# EAGLE design ihm_shield (EAGLE 7.2.0)
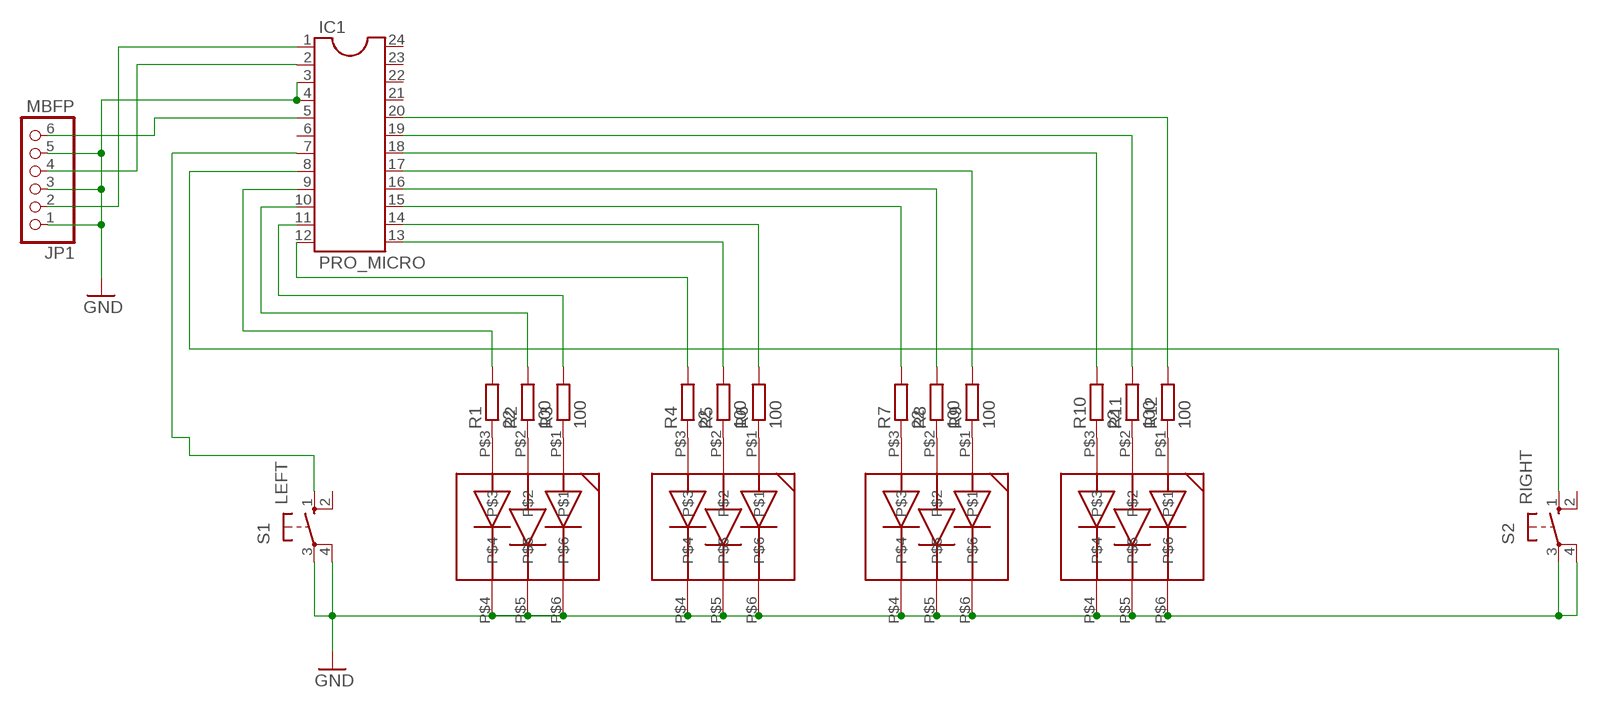
[diagram p0: schematic, sheet 1]

## Parts
IC1  PRO_MICRO  DIL24-6  [DIL24-6]
JP1  MBFP  PINHD-1X6/90  [1X06/90]
R1  22  R-EU_R0805  [R0805]
R2  100  R-EU_R0805  [R0805]
R3  100  R-EU_R0805  [R0805]
R4  22  R-EU_R0805  [R0805]
R5  100  R-EU_R0805  [R0805]
R6  100  R-EU_R0805  [R0805]
R7  22  R-EU_R0805  [R0805]
R8  100  R-EU_R0805  [R0805]
R9  100  R-EU_R0805  [R0805]
R10  22  R-EU_R0805  [R0805]
R11  100  R-EU_R0805  [R0805]
R12  100  R-EU_R0805  [R0805]
S1  LEFT  10-XX  [B3F-10XX]
S2  RIGHT  10-XX  [B3F-10XX]
U$1  5050LED  [PLCC-6]
U$2  5050LED  [PLCC-6]
U$3  5050LED  [PLCC-6]
U$4  5050LED  [PLCC-6]

## Nets
GND: IC1.3 IC1.4 JP1.1 JP1.3 JP1.5 S1.3(P) S1.4(P1) S2.3(P) S2.4(P1) U$1.P$4 U$1.P$5 U$1.P$6 U$2.P$4 U$2.P$5 U$2.P$6 U$3.P$4 U$3.P$5 U$3.P$6 U$4.P$4 U$4.P$5 U$4.P$6
N$1: R4.1 U$2.P$3
N$2: R5.1 U$2.P$2
N$3: R6.1 U$2.P$1
N$4: R7.1 U$3.P$3
N$5: R8.1 U$3.P$2
N$6: R9.1 U$3.P$1
N$7: R1.1 U$1.P$3
N$8: R2.1 U$1.P$2
N$9: R3.1 U$1.P$1
N$11: R10.1 U$4.P$3
N$12: R11.1 U$4.P$2
N$13: IC1.1 JP1.2
N$14: IC1.2 JP1.4
N$15: IC1.5 JP1.6
N$16: R12.1 U$4.P$1
N$17: IC1.20 R12.2
N$18: IC1.19 R11.2
N$19: IC1.18 R10.2
N$20: IC1.17 R9.2
N$21: IC1.16 R8.2
N$22: IC1.15 R7.2
N$23: IC1.14 R6.2
N$24: IC1.13 R5.2
N$25: IC1.12 R4.2
N$26: IC1.11 R3.2
N$27: IC1.10 R2.2
N$28: IC1.9 R1.2
N$29: IC1.7 S1.1(S)
N$30: IC1.8 S2.1(S)
Unconnected: IC1.6 IC1.21 IC1.22 IC1.23 IC1.24 S1.2(S1) S2.2(S1)

## Library data of the parts
IC1 = ic-package:DIL24: Dual In Line
JP1 = pinhead:PINHD-1X6: PIN HEADER
R1-R12 = rcl:R-EU_: RESISTOR, European symbol
S1 S2 = switch-omron:10-XX: OMRON SWITCH; MPN: B3F-1000; OC_FARNELL: 176432; OC_NEWARK: 36M3542
U$1-U$4 = 5050led:5050LED: Classical 5050 RGB LED in PLCC-6 package

## Board
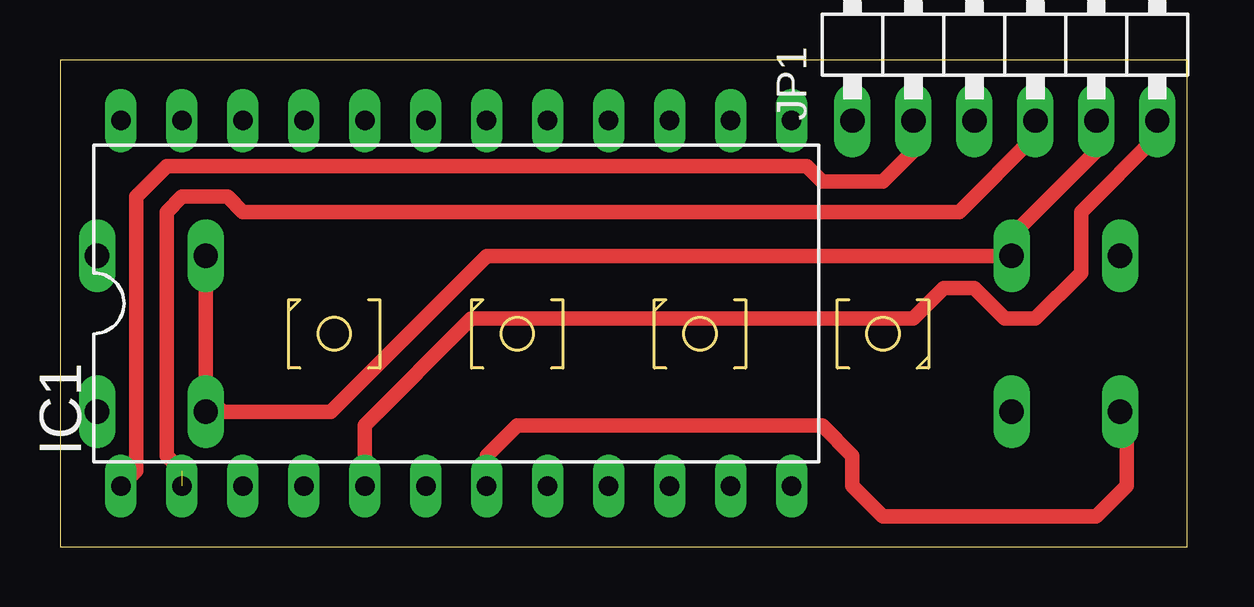
[diagram p1: board, top side]
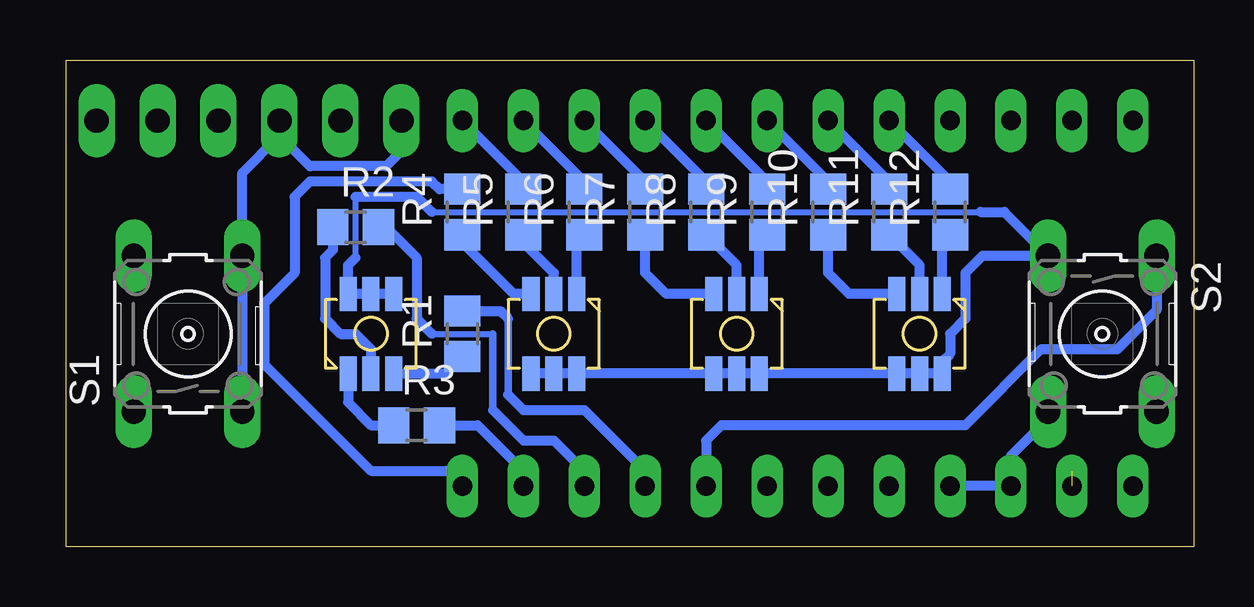
[diagram p2: board, bottom side, seen from below]

Size 46.98 x 20.31 mm. Coordinates in mm from the lower left corner, seen from the top.
Outline: 0,0 46.98,0 46.98,20.31 0,20.31 0,0
Copper layers (1*16): Top 0.035mm / dielectric 1.5mm / Bottom 0.035mm
Design rules "default": minimum track width 10mil, minimum drill 24mil, track to track 8mil, track to pad 8mil, pad to pad 8mil, via to via 8mil, smd to smd 8mil, copper to edge 40mil, drill to drill 8mil, minimum pad ring 10mil, minimum via ring 8mil, stop-mask expansion 4mil, vias tented up to drill 0mil, thermal gap 10mil

### Footprints (pad centres in the part's own frame; a part is rotated, then mirrored left to right if it is on the bottom)
DIL24-6 = drill 0.813 long: 1 -13.97,-7.62; 2 -11.43,-7.62; 3 -8.89,-7.62; 4 -6.35,-7.62; 5 -3.81,-7.62; 6 -1.27,-7.62; 7 1.27,-7.62; 8 3.81,-7.62; 9 6.35,-7.62; 10 8.89,-7.62; 11 11.43,-7.62; 12 13.97,-7.62; 13 13.97,7.62; 14 11.43,7.62; 15 8.89,7.62; 16 6.35,7.62; 17 3.81,7.62; 18 1.27,7.62; 19 -1.27,7.62; 20 -3.81,7.62; 21 -6.35,7.62; 22 -8.89,7.62; 23 -11.43,7.62; 24 -13.97,7.62
1X06/90 = drill 1.016 long: 1 -6.35,-3.81; 2 -3.81,-3.81; 3 -1.27,-3.81; 4 1.27,-3.81; 5 3.81,-3.81; 6 6.35,-3.81
R0805 = smd 1.3 x 1.5: 1 -0.95,0; 2 0.95,0
B3F-10XX = drill 1.016 long: 1 -3.251,2.261; 2 3.251,2.261; 3 -3.251,-2.261; 4 3.251,-2.261
PLCC-6 = smd 0.711 x 1.422: P$1 0.95,1.663; P$2 0,1.663; P$3 -0.95,1.663; P$4 -0.95,-1.663; P$5 0,-1.663; P$6 0.95,-1.663

### Placement (x,y rotation side)
IC1  16.51,10.16 0 top
JP1  39.37,21.59 0 top
R1  30.48,8.89 90 bottom
R2  34.92,13.34 0 bottom
R3  32.38,5.08 0 bottom
R4  30.48,13.97 90 bottom
R5  27.94,13.97 90 bottom
R6  25.4,13.97 90 bottom
R7  22.86,13.97 90 bottom
R8  20.32,13.97 90 bottom
R9  17.78,13.97 90 bottom
R10  15.24,13.97 90 bottom
R11  12.7,13.97 90 bottom
R12  10.16,13.97 90 bottom
S1  41.91,8.89 90 bottom
S2  3.81,8.89 270 bottom
U$1  34.29,8.89 180 bottom
U$2  26.67,8.89 0 bottom
U$3  19.05,8.89 0 bottom
U$4  11.43,8.89 0 bottom

### Tracks (layer width: path | path; a pad name or v marks a point on that pad's centre or on a via)
GND
  Top 0.61: JP1.5 43.18,16.51 39.65,12.98 S1.4 17.78,12.14 11.28,5.64 6.78,5.64 6.07,6.35 | S2.4 6.07,6.35 | 6.07,6.35 S2.3
  Bottom 0.254: 34.92,12.06 34.92,14.61 | 31.75,13.97 8.89,13.97
  Bottom 0.406: U$2.P$4 U$2.P$5 U$2.P$6 U$3.P$4 U$3.P$5 U$3.P$6 U$4.P$4 U$4.P$5 U$4.P$6 10.48,7.73 10.16,8.05 10.16,8.89 9.53,9.53 9.53,11.43 8.81,12.14 S2.3 7.9,13.97 8.89,13.97 | U$1.P$4 U$1.P$5 U$1.P$6 35.24,11.75 34.92,12.06 | 34.92,14.61 32.38,14.61 31.75,13.97 | S2.4 6.07,5.36 7.62,3.81 IC1.3 IC1.4 | JP1.1 33.02,16.51 33.66,15.88 36.83,15.88 38.1,17.14 | 38.1,17.14 JP1.3 | 38.1,17.14 39.65,15.6 S1.4 S1.3
N$1
  Bottom 0.406: U$2.P$3 28.33,10.55 30.48,12.7 R4.1
N$2
  Bottom 0.406: U$2.P$2 26.67,11.43 27.94,12.7 R5.1
N$3
  Bottom 0.406: U$2.P$1 25.72,12.7 R6.1
N$4
  Bottom 0.406: U$3.P$3 21.98,10.55 22.86,11.43 R7.1
N$5
  Bottom 0.406: U$3.P$2 19.05,11.75 R8.1
N$6
  Bottom 0.406: U$3.P$1 18.1,12.7 R9.1
N$7
  Bottom 0.406: U$1.P$3 31.19,7.23 R1.1
N$8
  Bottom 0.406: R2.1 35.88,12.38 36.2,12.06 36.2,9.53 35.56,8.89 34.92,8.89 34.29,8.26 U$1.P$2
N$9
  Bottom 0.406: U$1.P$1 35.24,6.03 34.29,5.08 R3.1
N$11
  Bottom 0.406: U$4.P$3 14.36,10.55 15.24,11.43 R10.1
N$12
  Bottom 0.406: U$4.P$2 11.43,11.75 R11.1
N$13
  Top 0.61: JP1.2 35.56,16.51 34.29,15.24 31.75,15.24 31.11,15.88 4.45,15.88 3.17,14.61 3.17,3.17 IC1.1
N$14  (1 unrouted)
  Top 0.61: JP1.4 40.64,17.14 37.47,13.97 7.62,13.97 6.99,14.61 5.08,14.61 4.45,13.97 4.45,3.81 5.08,3.17
N$15
  Top 0.61: IC1.5 12.7,5.08 17.14,9.53 35.56,9.53 36.83,10.79 38.1,10.79 39.37,9.53 40.64,9.53 42.55,11.43 42.55,13.97 45.72,17.14 JP1.6
N$16
  Bottom 0.406: U$4.P$1 10.48,12.38 10.16,12.7 R12.1
N$17
  Bottom 0.406: R12.2 10.16,15.24 IC1.20
N$18
  Bottom 0.406: R11.2 12.7,15.24 IC1.19
N$19
  Bottom 0.406: R10.2 15.24,15.24 IC1.18
N$20
  Bottom 0.406: R9.2 17.78,15.24 IC1.17
N$21
  Bottom 0.406: R8.2 20.32,15.24 IC1.16
N$22
  Bottom 0.406: R7.2 22.86,15.24 IC1.15
N$23
  Bottom 0.406: R6.2 25.4,15.24 IC1.14
N$24
  Bottom 0.406: R5.2 27.94,15.24 IC1.13
N$25
  Bottom 0.406: IC1.12 31.11,3.17 34.29,3.17 38.73,7.62 38.73,10.16 37.47,11.43 37.47,14.61 36.83,15.24 31.75,15.24 31.43,14.92 R4.2
N$26
  Bottom 0.406: R3.2 29.84,5.08 27.94,3.17 IC1.11
N$27
  Bottom 0.254: 31.75,8.89 29.21,8.89
  Bottom 0.305: 29.21,8.89 29.21,5.71
  Bottom 0.406: R2.2 33.66,13.34 32.38,12.06 32.38,9.53 31.75,8.89 | IC1.10 25.4,3.17 26.67,4.45 27.94,4.45 29.21,5.71
N$28
  Bottom 0.305: 28.57,9.53 28.57,6.35
  Bottom 0.406: R1.2 28.89,9.84 28.57,9.53 | 28.57,6.35 27.94,5.71 25.4,5.71 22.86,3.17 IC1.9
N$29
  Top 0.61: IC1.7 17.78,3.81 19.05,5.08 31.75,5.08 33.02,3.81 33.02,2.54 34.29,1.27 43.18,1.27 44.45,2.54 44.45,5.36 S1.1
N$30
  Bottom 0.406: S2.1 1.55,9.88 3.17,8.26 6.35,8.26 9.53,5.08 19.68,5.08 20.32,4.45 IC1.8